# EasyEDA Pro project Lib.epro

# Board PCB25
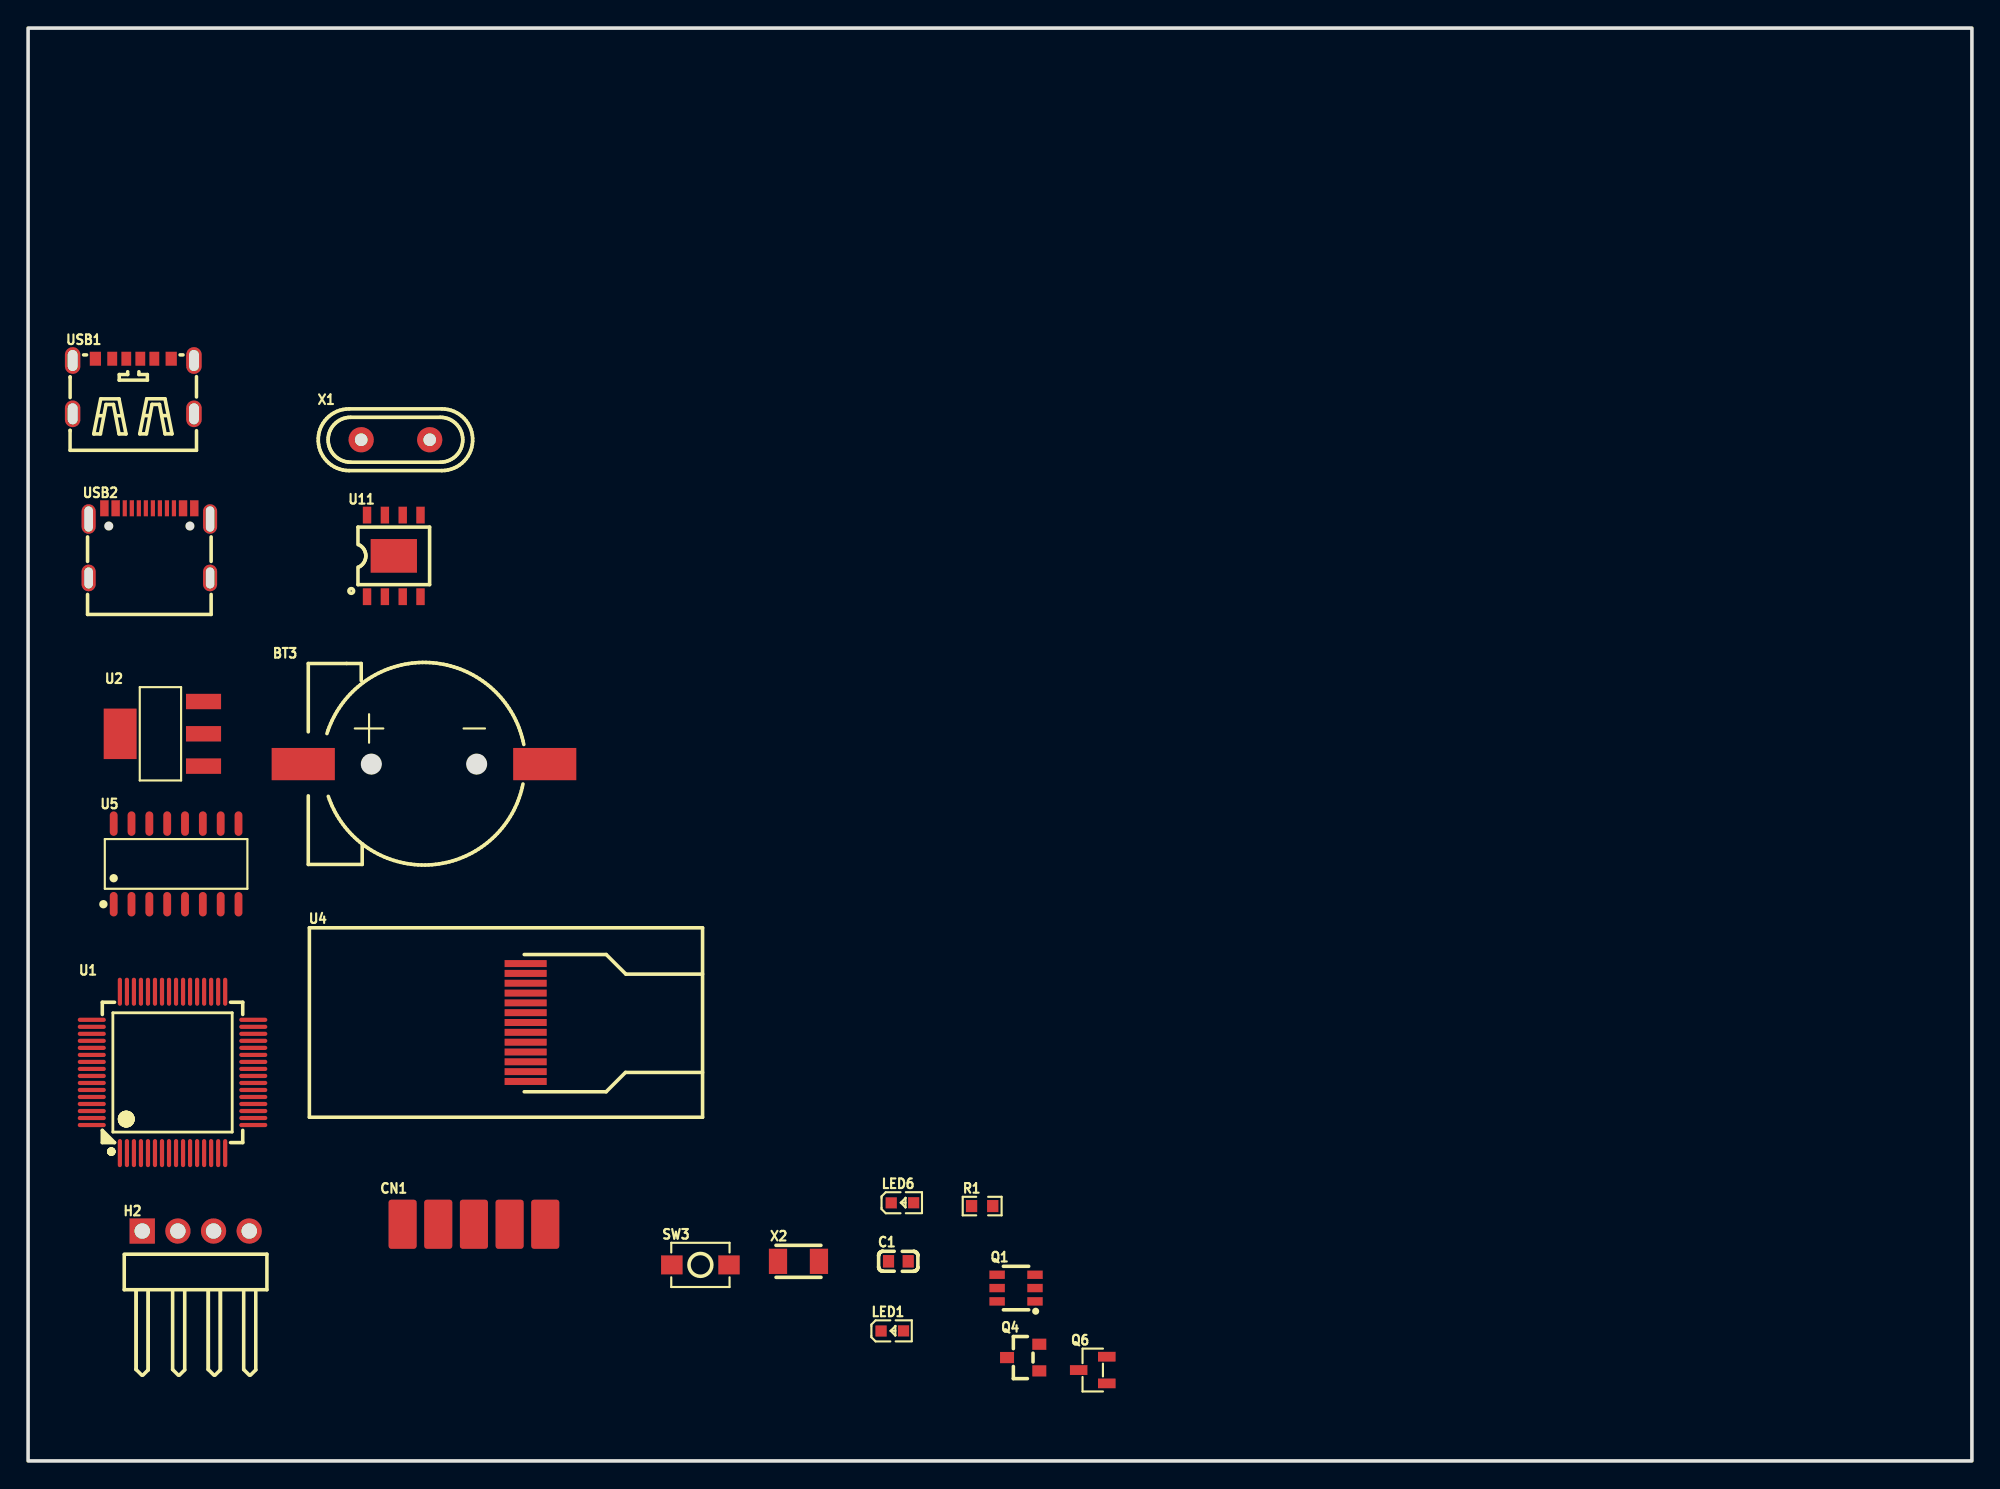
[diagram p0: board, top side]
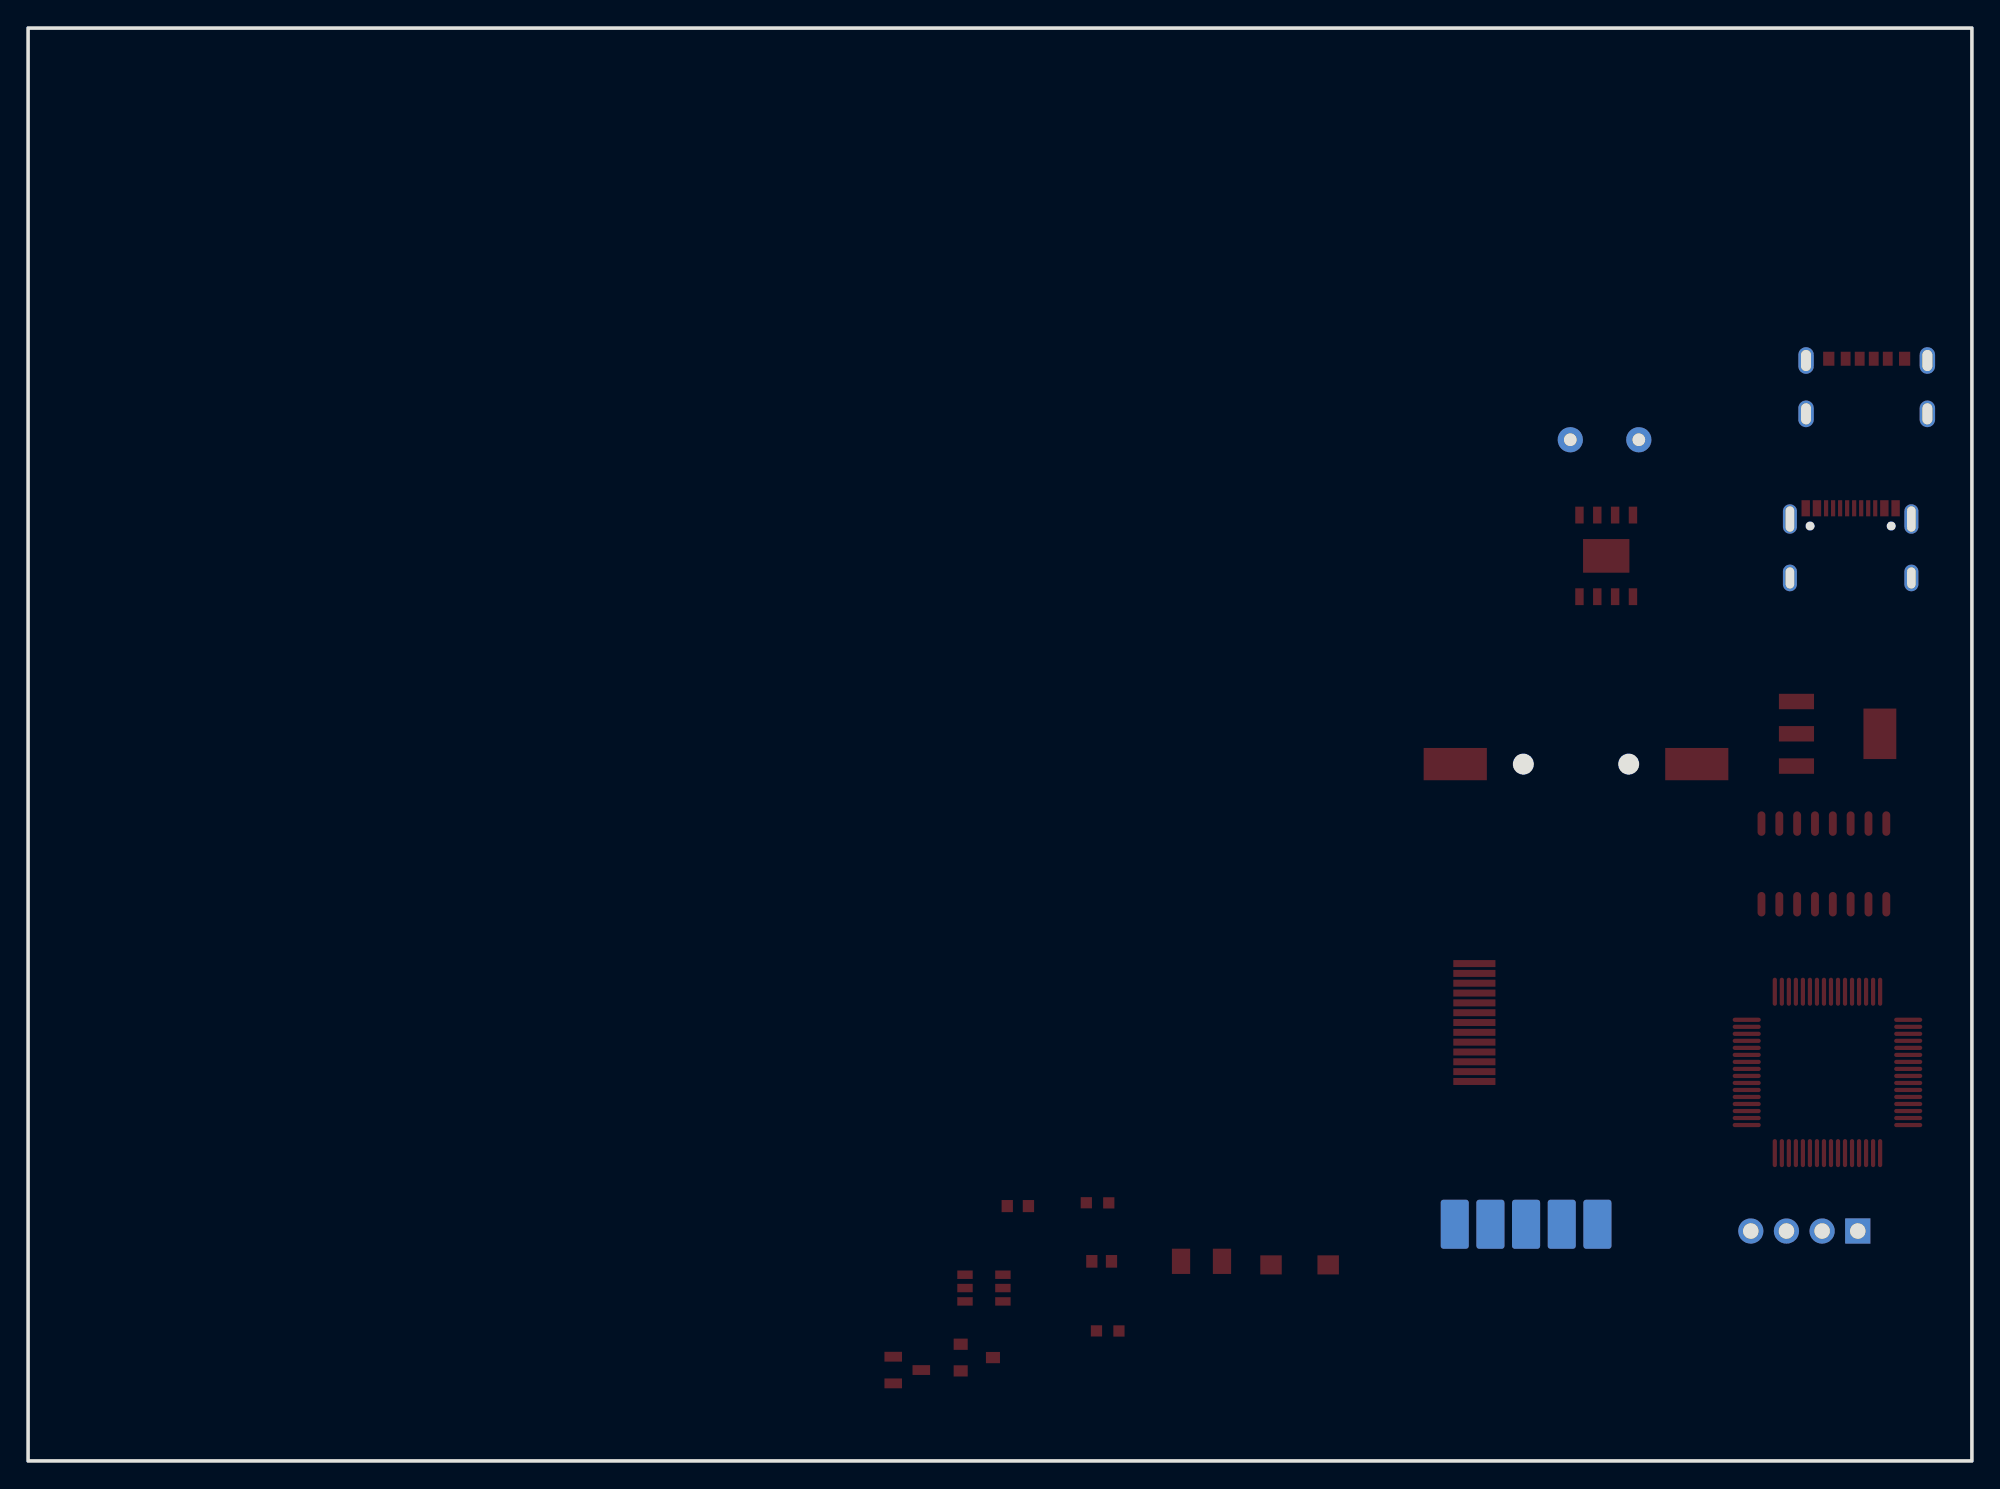
[diagram p1: board, bottom side, seen from below]

Outline 138.43 x 102.11 mm; copper layers: Top Layer, Bottom Layer. Coordinates in mm from the lower left corner of the outline.
Outline path: rectangle 0,102.11 138.43,0
Stack: Top Layer 0.035mm / Dielectric1 1.51mm FR4 er 4.5 / Bottom Layer 0.035mm

## Design rules (mm)
template: JLCPCB Capability(Two Layers Board)
spacing copperThickness1oz (default): track to track 0.102, other pairs 0.152 to 0.3
spacing copperThickness2oz: track to track 0.203, other pairs 0.152 to 0.3
track width copperThickness1oz (default): min 0.127, default 0.254, max 2.54
track width copperThickness2oz: min 0.203, default 0.254, max 2.54
differential pair differentialPair (default): width min 0.127, default 0.254, max 2.54; gap min 0.152, default 0.152
via viaSize (default): diameter min 0.5, default 0.61, max 10; hole min 0.3, default 0.305, max 6.3

## Placement (name value [footprint] x y rotation side)
BT3  BH500  [BAT-SMD_CR1220-2ZX]  28.19 49.66 0 top
C1  0.1u  [C0603]  61.98 14.22 0 top
CN1  ZX-PZ2.54-2-5PZZ  [hdr-th_10p-p2.54-v-m-r2-c5-s2.54]  31.75 10.03 0 top
H2  2.54-1*4P反弯排针  [HDR-TH_4P-P2.54-H-M-W10.4]  11.94 16.38 0 top
LED1  -  [LED_0603]  61.59 9.27 0 top
LED6  KT-0603R  [LED0603-RD]  62.27 18.39 0 top
Q1  DW01  [SOT-23-6_L2.9-W1.6-P0.95-LS2.8-BR]  70.36 12.32 0 top
Q4  -  [S8050_SOT-23]  70.87 7.24 0 top
Q6  2N3904(SOT-23)  [sot-23-3_l2.9-w1.3-p1.90-ls2.4-br]  75.82 6.48 0 top
R1  10K  [R0603]  67.95 18.16 0 top
SW3  -  [Key_SMD_3x4x2]  47.88 13.97 0 top
U1  GD32VF103R8T6  [LQFP-64_L10.0-W10.0-P0.50-LS12.0-BL]  10.29 27.69 0 top
U2  AMS1117-3.3  [SOT-223-3_L6.5-W3.4-P2.30-LS7.0-BR]  9.52 51.82 0 top
U4  HS096T01H13  [LCD-SMD_HS096T01H13]  35.43 31.24 0 top
U5  CH340C  [SOP-16_L10.0-W3.9-P1.27-LS6.0-BL]  10.54 42.54 0 top
U11  TP4056  [esop-8_l4.9-w3.9-p1.27-ls6.0-bl-ep]  26.04 64.5 0 top
USB1  TYPE-C 6P  [TYPE-C-SMD_TYPE-C-6P]  7.49 76.58 0 top
USB2  TYPEC-304J-BCP16  [USB-C-SMD_TYPEC-304J-BCP16]  8.64 65.4 0 top
X1  8MHz  [HC-49S_L10.8-W4.5-P4.88]  26.16 72.77 0 top
X2  32.768k  [CRYSTAL-SMD_L3.2-W1.5]  54.86 14.22 0 top

## Footprints (pads in the part's own frame, mm; a bottom-side part is the same pattern mirrored in y, then rotated)
BAT-SMD_CR1220-2ZX
  rect 4.5x2.3 smd: 1(-8.6,0) 2(8.6,0)
C0603
  rect 0.8x0.9 smd: 1(-0.7,0) 2(0.7,0)
CRYSTAL-SMD_L3.2-W1.5
  rect 1.3x1.8 smd: 1(-1.458,0) 2(1.458,0)
esop-8_l4.9-w3.9-p1.27-ls6.0-bl-ep
  rect 0.6x1.2 smd: 1(-1.905,-2.909) 2(-0.635,-2.909) 3(0.635,-2.909) 4(1.905,-2.909) 5(1.905,2.909) 6(0.635,2.909) 7(-0.635,2.909) 8(-1.905,2.909)
  rect 3.3x2.4 smd: 9(0,0)
HC-49S_L10.8-W4.5-P4.88
  round 1.8 hole 0.9: 1(-2.44,0) 2(2.44,0)
HDR-TH_4P-P2.54-H-M-W10.4
  rect 1.8x1.8 hole 1.1: 1(-3.81,0)
  round 1.8 hole 1.1: 2(-1.27,0) 3(1.27,0) 4(3.81,0)
hdr-th_10p-p2.54-v-m-r2-c5-s2.54
  rrect 2x3.5 smd: 1(5.08,6.832) 3(2.54,6.832) 5(0,6.832) 7(-2.54,6.832) 9(-5.08,6.832)
  rrect 2x3.5 smd far side: 2(5.08,6.832) 4(2.54,6.832) 6(0,6.832) 8(-2.54,6.832) 10(-5.08,6.832)
Key_SMD_3x4x2
  rect 1.53x1.36 smd: 1(-2.035,0) 2(2.035,0)
LCD-SMD_HS096T01H13
  rect 3x0.5 smd: 1(0,4.2) 2(0,3.5) 3(0,2.8) 4(0,2.1) 5(0,1.4) 6(0,0.7) 7(0,0) 8(0,-0.7) 9(0,-1.4) 10(0,-2.1) 11(0,-2.8) 12(0,-3.5) 13(0,-4.2)
LED0603-RD
  rect 0.8x0.8 smd: 1(-0.799,-0.004) 2(0.799,0.004)
LED_0603
  rect 0.8x0.8 smd: 1(-0.851,-0.01) 2(0.75,-0.005)
LQFP-64_L10.0-W10.0-P0.50-LS12.0-BL
  oval 0.3x2 smd: 1(-3.75,-5.75) 2(-3.25,-5.75) 3(-2.75,-5.75) 4(-2.25,-5.75) 5(-1.75,-5.75) 6(-1.25,-5.75) 7(-0.75,-5.75) 8(-0.25,-5.75) 9(0.25,-5.75) 10(0.75,-5.75) 11(1.25,-5.75) 12(1.75,-5.75) 13(2.25,-5.75) 14(2.75,-5.75) 15(3.25,-5.75) 16(3.75,-5.75) 33(3.75,5.75) 34(3.25,5.75) 35(2.75,5.75) 36(2.25,5.75) 37(1.75,5.75) 38(1.25,5.75) 39(0.75,5.75) 40(0.25,5.75) 41(-0.25,5.75) 42(-0.75,5.75) 43(-1.25,5.75) 44(-1.75,5.75) 45(-2.25,5.75) 46(-2.75,5.75) 47(-3.25,5.75) 48(-3.75,5.75)
  oval 2x0.3 smd: 17(5.75,-3.75) 18(5.75,-3.25) 19(5.75,-2.75) 20(5.75,-2.25) 21(5.75,-1.75) 22(5.75,-1.25) 23(5.75,-0.75) 24(5.75,-0.25) 25(5.75,0.25) 26(5.75,0.75) 27(5.75,1.25) 28(5.75,1.75) 29(5.75,2.25) 30(5.75,2.75) 31(5.75,3.25) 32(5.75,3.75) 49(-5.75,3.75) 50(-5.75,3.25) 51(-5.75,2.75) 52(-5.75,2.25) 53(-5.75,1.75) 54(-5.75,1.25) 55(-5.75,0.75) 56(-5.75,0.25) 57(-5.75,-0.25) 58(-5.75,-0.75) 59(-5.75,-1.25) 60(-5.75,-1.75) 61(-5.75,-2.25) 62(-5.75,-2.75) 63(-5.75,-3.25) 64(-5.75,-3.75)
R0603
  rect 0.806x0.864 smd: 1(-0.753,0) 2(0.753,0)
S8050_SOT-23
  rect 1x0.8 smd: 1(1.15,-0.823) 2(1.15,1.077) 3(-1.15,0.127)
SOP-16_L10.0-W3.9-P1.27-LS6.0-BL
  oval 0.56x1.745 smd: 1(-4.445,-2.873) 2(-3.175,-2.873) 3(-1.905,-2.873) 4(-0.635,-2.873) 5(0.635,-2.873) 6(1.905,-2.873) 7(3.175,-2.873) 8(4.445,-2.873) 9(4.445,2.873) 10(3.175,2.873) 11(1.905,2.873) 12(0.635,2.873) 13(-0.635,2.873) 14(-1.905,2.873) 15(-3.175,2.873) 16(-4.445,2.873)
sot-23-3_l2.9-w1.3-p1.90-ls2.4-br
  rect 1.25x0.7 smd: 1(1,-0.95) 2(1,0.95) 3(-1,0)
SOT-23-6_L2.9-W1.6-P0.95-LS2.8-BR
  rect 1.1x0.6 smd: 1(1.35,-0.95) 2(1.35,0) 3(1.35,0.95) 4(-1.35,0.95) 5(-1.35,0) 6(-1.35,-0.95)
SOT-223-3_L6.5-W3.4-P2.30-LS7.0-BR
  rect 2.5x1.1 smd: 1(2.97,-2.3) 2(2.97,0) 3(2.97,2.3)
  rect 2.34x3.6 smd: 4(-2.97,0)
TYPE-C-SMD_TYPE-C-6P
  oval 1.1x1.9 hole 0.7x1.5: 7(-4.32,1.837) 7(-4.32,-1.962) 7(4.32,1.837) 7(4.32,-1.962)
  rect 0.7x1 smd: A5(-0.5,1.962) A9(1.5,1.962) B5(0.5,1.962) B9(-1.5,1.962)
  rect 0.8x1 smd: A12(2.7,1.962) B12(-2.7,1.962)
USB-C-SMD_TYPEC-304J-BCP16
  oval 1x2.1 hole 0.6x1.8: 13(-4.325,1.718) 14(4.325,1.718)
  oval 1x1.9 hole 0.6x1.5: 15(-4.325,-2.482) 16(4.325,-2.482)
  rect 0.6x1.15 smd: A1B12(-3.2,2.482) A4B9(-2.4,2.482) B1A12(3.2,2.482) B4A9(2.4,2.482)
  rect 0.3x1.15 smd: A5(-1.25,2.482) A6(-0.25,2.482) A7(0.25,2.482) A8(1.25,2.482) B5(1.75,2.482) B6(0.75,2.482) B7(-0.75,2.482) B8(-1.75,2.482)

## Nets
+5V: CN1.9 LED6.2 U2.3 U11.4 U11.8 USB1.A9 USB1.B9 USB2.A4B9 USB2.B4A9
GND: C1.1 CN1.5 CN1.6 H2.4 Q1.6 Q4.2 Q6.1 U1.12 U1.18 U1.31 U1.47 U1.63 U2.1 U4.8 U4.13 U5.1 U11.1 U11.3 U11.9 USB1.7 USB1.A12 USB1.B12 USB2.13 USB2.14 USB2.15 USB2.16 USB2.A1B12 USB2.B1A12
VCC: C1.2 CN1.7 CN1.8 H2.1 LED1.2 R1.2 SW3.1 U1.1 U1.13 U1.19 U1.32 U1.48 U1.64 U2.2 U2.4 U4.10 U5.16
BAT+: BT3.1 U11.5
BAT-: BT3.2
BLK: U1.24
BOOT0: SW3.2 U1.60
BOOT1: U1.28
BUZ: U1.52
CS: U1.20 U4.7
DP+: U5.5 USB2.A6 USB2.B6
DP-: U5.6 USB2.A7 USB2.B7
LED_K: U4.11
NRST: R1.1 U1.7
OSC32_IN: U1.3 X2.2
OSC32_OUT: U1.4 X2.1
OSC_IN: U1.5 X1.2
OSC_OUT: U1.6 X1.1
PA9: CN1.2 H2.3 U1.42 U5.3
PA10: CN1.4 H2.2 U1.43 U5.2
PC13: U1.2
RES: U1.25 U4.6
RS: U1.17 U4.5
SCL: U1.21 U4.4
SDA: U1.23 U4.3
SWCLK: CN1.1 U1.49
SWDIO: CN1.3 U1.50
$1N3244: LED1.1
$1N3280: Q1.2
$1N3281: Q1.5
$1N3299: U4.12
$1N3320: Q4.3
$1N3321: Q4.1
$1N3342: U5.4
$1N3364: U11.2
$1N3367: U11.7
$1N3368: LED6.1
$1N3370: U11.6
$1N3387: Q1.1
$1N3388: Q1.3
$1N9840: Q6.2
$1N9844: Q6.3

Pads without a net: CN1 10; Q1 4; U1 8 9 10 11 14 15 16 22 26 27 29 30 33 34 35 36 37 38 39 40 41 44 45 46 51 53 54 55 56 57 58 59 61 62; U4 1 2 9; U5 7 8 9 10 11 12 13 14 15; USB1 A5 B5; USB2 A5 A8 B5 B8
